# Altium schematic sheet 08_Parallel_operation.SchDoc
size A4; Organization: OLTEST; Revision: 01; SheetNumber: 8; SheetTotal: 13; Название листа: Название листа; Разработчик: Бондарчук С.; Прибор: R100; АМАК.000000.000 Э3: R100.230.030.000-00; Дата: 16.04.2019; Формат: A4; workspacename: R100_Boards_v1; PageSetup: Record=PageOptions|CenterHorizontal=True|CenterVertical=True|PrintScale=0.97|XCorrection=1.00|YCorrection=1.00|PrintKind=0|BorderSize=5000000|LeftOffset=0|BottomOffset=0|Orientation=2|PaperLength=1000|PaperWidth=1000|Scale=100|PaperSource=7|PrintQuality=-3|MediaType=1|DitherType=10|PrintScaleMode=1|PaperKind=A4|PaperIndex=9
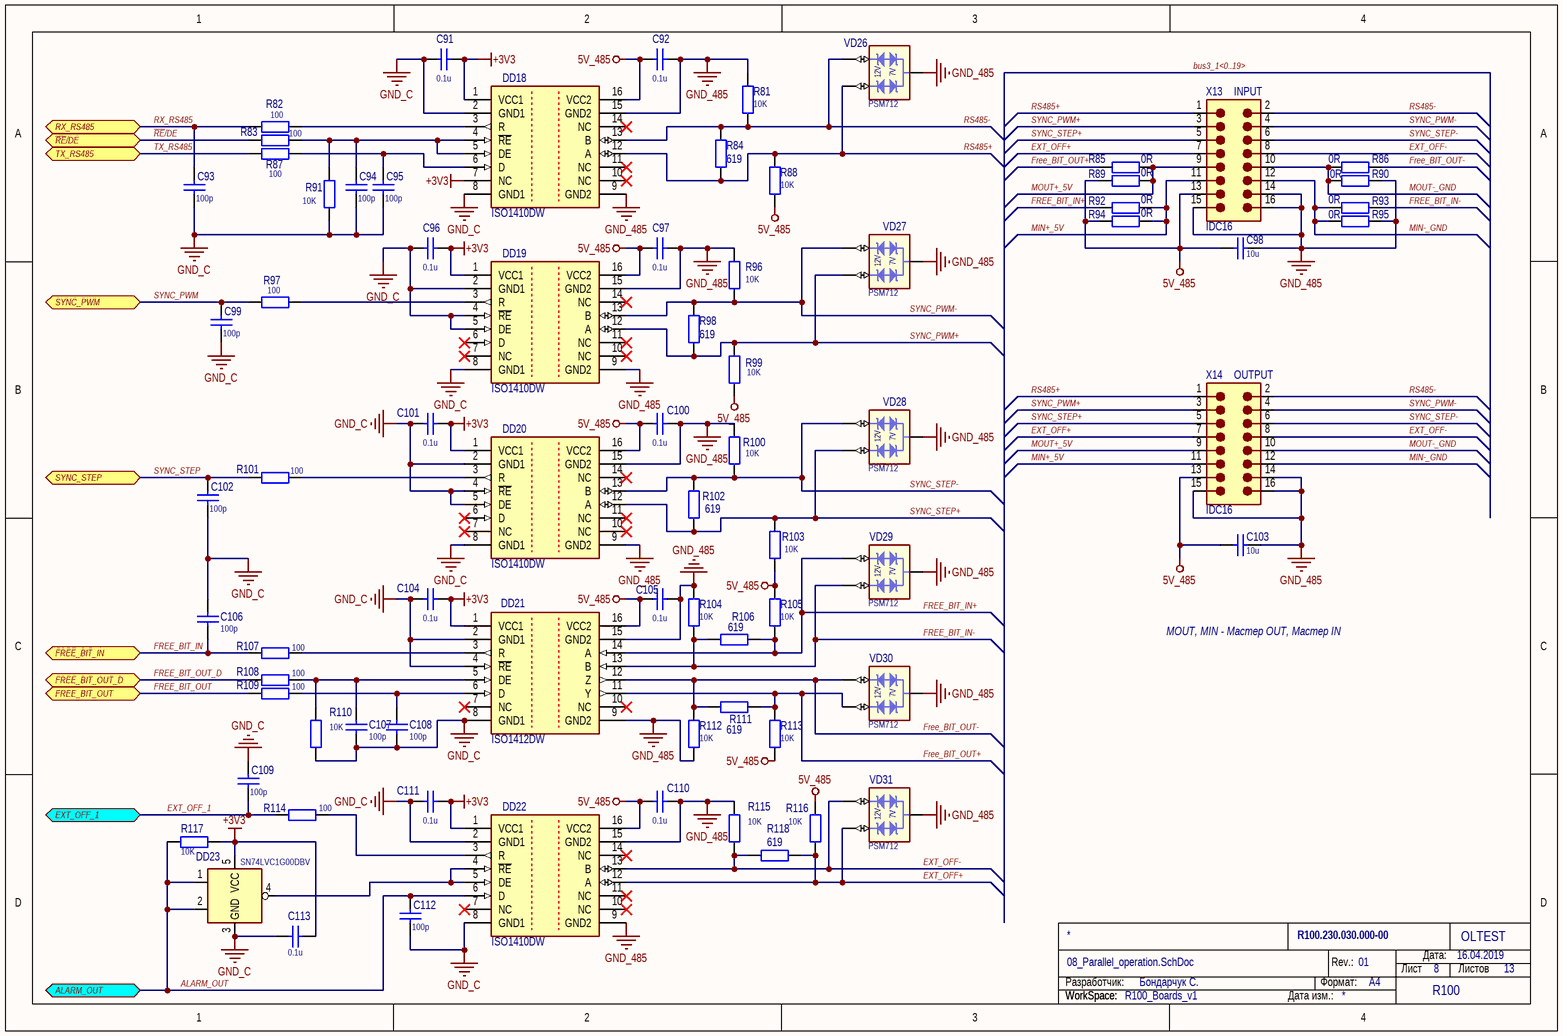
[diagram p0: 08_Parallel_operation.SchDoc]

## Parts
C91  0.1u  [SMD_C_0603]
C92  0.1u  [SMD_C_0603]
C93  100p  [SMD_C_0603]
C94  100p  [SMD_C_0603]
C95  100p  [SMD_C_0603]
C96  0.1u  [SMD_C_0603]
C97  0.1u  [SMD_C_0603]
C98  10u  [SMD_C_1206]
C99  100p  [SMD_C_0603]
C100  0.1u  [SMD_C_0603]
C101  0.1u  [SMD_C_0603]
C102  100p  [SMD_C_0603]
C103  10u  [SMD_C_1206]
C104  0.1u  [SMD_C_0603]
C105  0.1u  [SMD_C_0603]
C106  100p  [SMD_C_0603]
C107  100p  [SMD_C_0603]
C108  100p  [SMD_C_0603]
C109  100p  [SMD_C_0603]
C110  0.1u  [SMD_C_0603]
C111  0.1u  [SMD_C_0603]
C112  100p  [SMD_C_0603]
C113  0.1u  [SMD_C_0603]
DD18  ISO1410DW  [SOIC127P1030X265-16M]
DD19  ISO1410DW  [SOIC127P1030X265-16M]
DD20  ISO1410DW  [SOIC127P1030X265-16M]
DD21  ISO1412DW  [SOIC127P1030X265-16M]
DD22  ISO1410DW  [SOIC127P1030X265-16M]
DD23  SN74LVC1G00DBV  [SOT-23(DBV)]
R81  10K  [SMD_R_0603]
R82  100  [SMD_R_0603]
R83  100  [SMD_R_0603]
R84  619  [SMD_R_0603]
R85  0R  [SMD_R_0603]
R86  0R  [SMD_R_0603]
R87  100  [SMD_R_0603]
R88  10K  [SMD_R_0603]
R89  0R  [SMD_R_0603]
R90  0R  [SMD_R_0603]
R91  10K  [SMD_R_0603]
R92  0R  [SMD_R_0603]
R93  0R  [SMD_R_0603]
R94  0R  [SMD_R_0603]
R95  0R  [SMD_R_0603]
R96  10K  [SMD_R_0603]
R97  100  [SMD_R_0603]
R98  619  [SMD_R_0603]
R99  10K  [SMD_R_0603]
R100  10K  [SMD_R_0603]
R101  100  [SMD_R_0603]
R102  619  [SMD_R_0603]
R103  10K  [SMD_R_0603]
R104  10K  [SMD_R_0603]
R105  10K  [SMD_R_0603]
R106  619  [SMD_R_0603]
R107  100  [SMD_R_0603]
R108  100  [SMD_R_0603]
R109  100  [SMD_R_0603]
R110  10K  [SMD_R_0603]
R111  619  [SMD_R_0603]
R112  10K  [SMD_R_0603]
R113  10K  [SMD_R_0603]
R114  100  [SMD_R_0603]
R115  10K  [SMD_R_0603]
R116  10K  [SMD_R_0603]
R117  10K  [SMD_R_0603]
R118  619  [SMD_R_0603]
VD26  PSM712  [SOT23-3]
VD27  PSM712  [SOT23-3]
VD28  PSM712  [SOT23-3]
VD29  PSM712  [SOT23-3]
VD30  PSM712  [SOT23-3]
VD31  PSM712  [SOT23-3]
X13  IDC16  [918516x324]
X14  IDC16  [918516x324]

## Ports
ALARM_OUT (bidir), EXT_OFF_1 (bidir), FREE_BIT_IN (bidir), FREE_BIT_OUT (bidir), FREE_BIT_OUT_D (bidir), RX_RS485, SYNC_PWM (bidir), SYNC_STEP (bidir), TX_RS485 (bidir), ~{RE}/DE (bidir)

## Nets
5V_485: C92.2 C97.2 C98.2 C100.2 C103.2 C105.2 C110.2 DD18.16(VCC2) DD19.16(VCC2) DD20.16(VCC2) DD21.16(VCC2) DD22.16(VCC2) R88.1 R89.1 R94.1 R99.1 R103.1 R105.2 R113.1 R116.2 X13.13 X14.13
+3V3: C91.1 C96.2 C101.2 C104.2 C111.2 C113.1 DD18.1(VCC1) DD18.7(NC) DD19.1(VCC1) DD20.1(VCC1) DD21.1(VCC1) DD22.1(VCC1) DD23.5(VCC) R117.1
GND_485: C92.1 C97.1 C98.1 C100.1 C103.1 C105.1 C110.1 DD18.9(GND2) DD18.15(GND2) DD19.9(GND2) DD19.15(GND2) DD20.9(GND2) DD20.15(GND2) DD21.9(GND2) DD21.15(GND2) DD22.9(GND2) DD22.15(GND2) R81.1 R90.2 R95.2 R96.2 R100.2 R104.2 R112.1 R115.2 VD26.3(GND) VD27.3(GND) VD28.3(GND) VD29.3(GND) VD30.3(GND) VD31.3(GND) X13.14 X13.15 X13.16 X14.14 X14.15 X14.16
GND_C: C91.2 C93.1 C94.1 C95.1 C96.1 C99.1 C101.1 C102.1 C104.1 C106.1 C107.2 C108.2 C109.2 C111.1 C112.1 C113.2 DD18.2(GND1) DD18.8(GND1) DD19.2(GND1) DD19.4(~{RE}) DD19.5(DE) DD19.8(GND1) DD20.2(GND1) DD20.4(~{RE}) DD20.5(DE) DD20.8(GND1) DD21.2(GND1) DD21.4(~{RE}) DD21.8(GND1) DD22.2(GND1) DD22.8(GND1) DD23.3(GND) R91.1 R110.1
~{RE}/DE: R83.1 ; port ~{RE}/DE
ALARM_OUT: C112.2 DD22.6(D) DD23.1 DD23.2 R117.2 ; port ALARM_OUT
EXT_OFF+: DD22.12(A) R116.1 R118.1 VD31.2(I/O2) X13.7 X14.7
EXT_OFF-: DD22.13(B) R115.1 R118.2 VD31.1(I/O1) X13.8 X14.8
EXT_OFF_1: C109.1 R114.1 ; port EXT_OFF_1
FREE_BIT_IN: C106.2 R107.1 ; port FREE_BIT_IN
FREE_BIT_IN+: DD21.14(A) R92.1 R105.1 R106.1 VD29.1(I/O1)
FREE_BIT_IN-: DD21.13(B) R93.2 R104.1 R106.2 VD29.2(I/O2)
FREE_BIT_OUT: R109.1 ; port FREE_BIT_OUT
Free_BIT_OUT+: DD21.11(Y) R85.1 R111.1 R113.2 VD30.2(I/O2)
Free_BIT_OUT-: DD21.12(Z) R86.2 R111.2 R112.2 VD30.1(I/O1)
FREE_BIT_OUT_D: R108.1 ; port FREE_BIT_OUT_D
MIN+_5V: R92.2 R94.2 X13.11 X14.11
MIN-_GND: R93.1 R95.1 X13.12 X14.12
MOUT+_5V: R85.2 R89.2 X13.9 X14.9
MOUT-_GND: R86.1 R90.1 X13.10 X14.10
RS485+: DD18.12(A) R84.1 R88.2 VD26.2(I/O2) X13.1 X14.1
RS485-: DD18.13(B) R81.2 R84.2 VD26.1(I/O1) X13.2 X14.2
RX_RS485: C93.2 R82.1 ; port RX_RS485
SYNC_PWM: C99.2 R97.1 ; port SYNC_PWM
SYNC_PWM+: DD19.12(A) R98.1 R99.2 VD27.2(I/O2) X13.3 X14.3
SYNC_PWM-: DD19.13(B) R96.1 R98.2 VD27.1(I/O1) X13.4 X14.4
SYNC_STEP: C102.2 R101.1 ; port SYNC_STEP
SYNC_STEP+: DD20.12(A) R102.1 R103.2 VD28.2(I/O2) X13.5 X14.5
SYNC_STEP-: DD20.13(B) R100.1 R102.2 VD28.1(I/O1) X13.6 X14.6
TX_RS485: R87.1 ; port TX_RS485
NetC94_2: C94.2 DD18.4(~{RE}) DD18.5(DE) R83.2 R91.2
NetC95_2: C95.2 DD18.6(D) R87.2
NetC107_1: C107.1 DD21.5(DE) R108.2 R110.2
NetC108_1: C108.1 DD21.6(D) R109.2
NetDD18_3: DD18.3(R) R82.2
NetDD19_3: DD19.3(R) R97.2
NetDD20_3: DD20.3(R) R101.2
NetDD21_3: DD21.3(R) R107.2
NetDD22_3: DD22.3(R) R114.2
NetDD22_4: DD22.4(~{RE}) DD22.5(DE) DD23.4

Not connected (* = marked no-connect by the designer): DD18 10(NC)* 11(NC)* 14(NC)*; DD19 6(D)* 7(NC)* 10(NC)* 11(NC)* 14(NC)*; DD20 6(D)* 7(NC)* 10(NC)* 11(NC)* 14(NC)*; DD21 7(NC)* 10(NC)*; DD22 7(NC)* 10(NC)* 11(NC)* 14(NC)*

## Buses and harness runs
bus bus3_1<0..19>

## Notes on the sheet
- (near X13) INPUT
- (near X14) OUTPUT
- MOUT, MIN - Мастер OUT, Мастер IN
- Разработчик:
- Формат:
- Rev.:
- Лист
- Дата:
- Листов
- WorkSpace:
- Дата изм.:
- (in symbol PSM712) 12V; 7V
- (in symbol SN74LVC1G00DBV) &

## Library data of the parts
C91 C92 C96 C97 C100 C101 C104 C105 C110 C111 C113 = C0603 0.1u 50V 10%: SMD C 0603 MURATA 50V 10% X7R; PartNumber: GRM188R71H104K; Manufacturer: MURATA; Value: 0.1u
C93-C95 C99 C102 C106-C109 C112 = C0603 100p 100V 5%: SMD C 0603 MURATA 100V 5% NP0; PartNumber: GRM1885C2A101JA01; Manufacturer: MURATA; Value: 100p
C98 C103 = C1206 10u 25V 20%: SMD C 1206 MURATA 25V 20% X5R; PartNumber: GRM31MR61E106M; Manufacturer: MURATA; Value: 10u
DD18-DD20 DD22 = ISO1410DW: Isolated, Half-Dupl RS-485 Transiver; Manufacturer: Texas Instrument; Inputs/Outputs: true; PartNumber: ISO1410DW
DD21 = ISO1412DW: Isolated, Full-Dupl RS-485 Transiver; Manufacturer: Texas Instrument; Inputs/Outputs: true; PartNumber: ISO1412DW
DD23 = SN74LVC1G00DBV: 2-in NAND; Manufacturer: Texas Instruments; PartNumber: SN74LVC1G00DBV
R81 R88 R91 R96 R99 R100 R103-R105 R110 R112 R113 R115-R117 = R0603 10К 1%: SMD R 0603 VISHAY 0.1W 75V 1% 100ppm; PartNumber: CRCW060310K0FK; Manufacturer: VISHAY; Value: 10K
R82 R83 R87 R97 R101 R107-R109 R114 = R0603 100 1%: SMD R 0603 VISHAY 0.1W 75V 1% 100ppm; PartNumber: CRCW0603100RFK; Manufacturer: VISHAY; Value: 100
R84 R98 R102 R106 R111 R118 = R0603 619 1%: SMD 0603 VISHAY 0.1W 75V 1% 100ppm; PartNumber: CRCW0603619RFK; Manufacturer: VISHAY; Value: 619
R85 R86 R89 R90 R92-R95 = R0603 0R 1%: SMD R 0603 VISHAY 0.1W 75V 1% 100ppm; PartNumber: CRCW06030000Z0; Manufacturer: VISHAY; Value: 0R
VD26-VD31 = PSM712: ASYMMETRICAL DATA LINE PROTECTOR; Manufacturer: Protec Devices; PartNumber: PSM712
X13 X14 = IDC16 324 Harting: Flat Cable Connector (IDC), Low-Profile Male Header, Straight Solder Pin, 16 Contacts, Performance Level 2; PartNumber: 09 18 516 6324; Manufacturer: HARTING